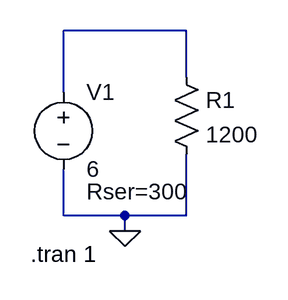
[diagram p0: schematic tran1.asc]
tran1.asc, the LTspice schematic file:
Version 4
SHEET 1 880 680
WIRE -336 -144 -464 -144
WIRE -336 -96 -336 -144
WIRE -464 -80 -464 -144
WIRE -464 48 -464 0
WIRE -400 48 -464 48
WIRE -336 48 -336 -16
WIRE -336 48 -400 48
WIRE -400 64 -400 48
FLAG -400 64 0
SYMBOL voltage -464 -96 R0
WINDOW 123 0 0 Left 0
WINDOW 39 24 119 Left 2
SYMATTR InstName V1
SYMATTR Value 6
SYMATTR SpiceLine Rser=300
SYMBOL res -352 -112 R0
SYMATTR InstName R1
SYMATTR Value 1200
TEXT -498 88 Left 2 !.tran 1

The netlist it stands for:
* tran1.asc
V1 N001 0 6 Rser=300
R1 N001 0 1200
.tran 1
.backanno
.end